# EAGLE design tick-display-mk-2.1-mini (EAGLE 6.5.0)
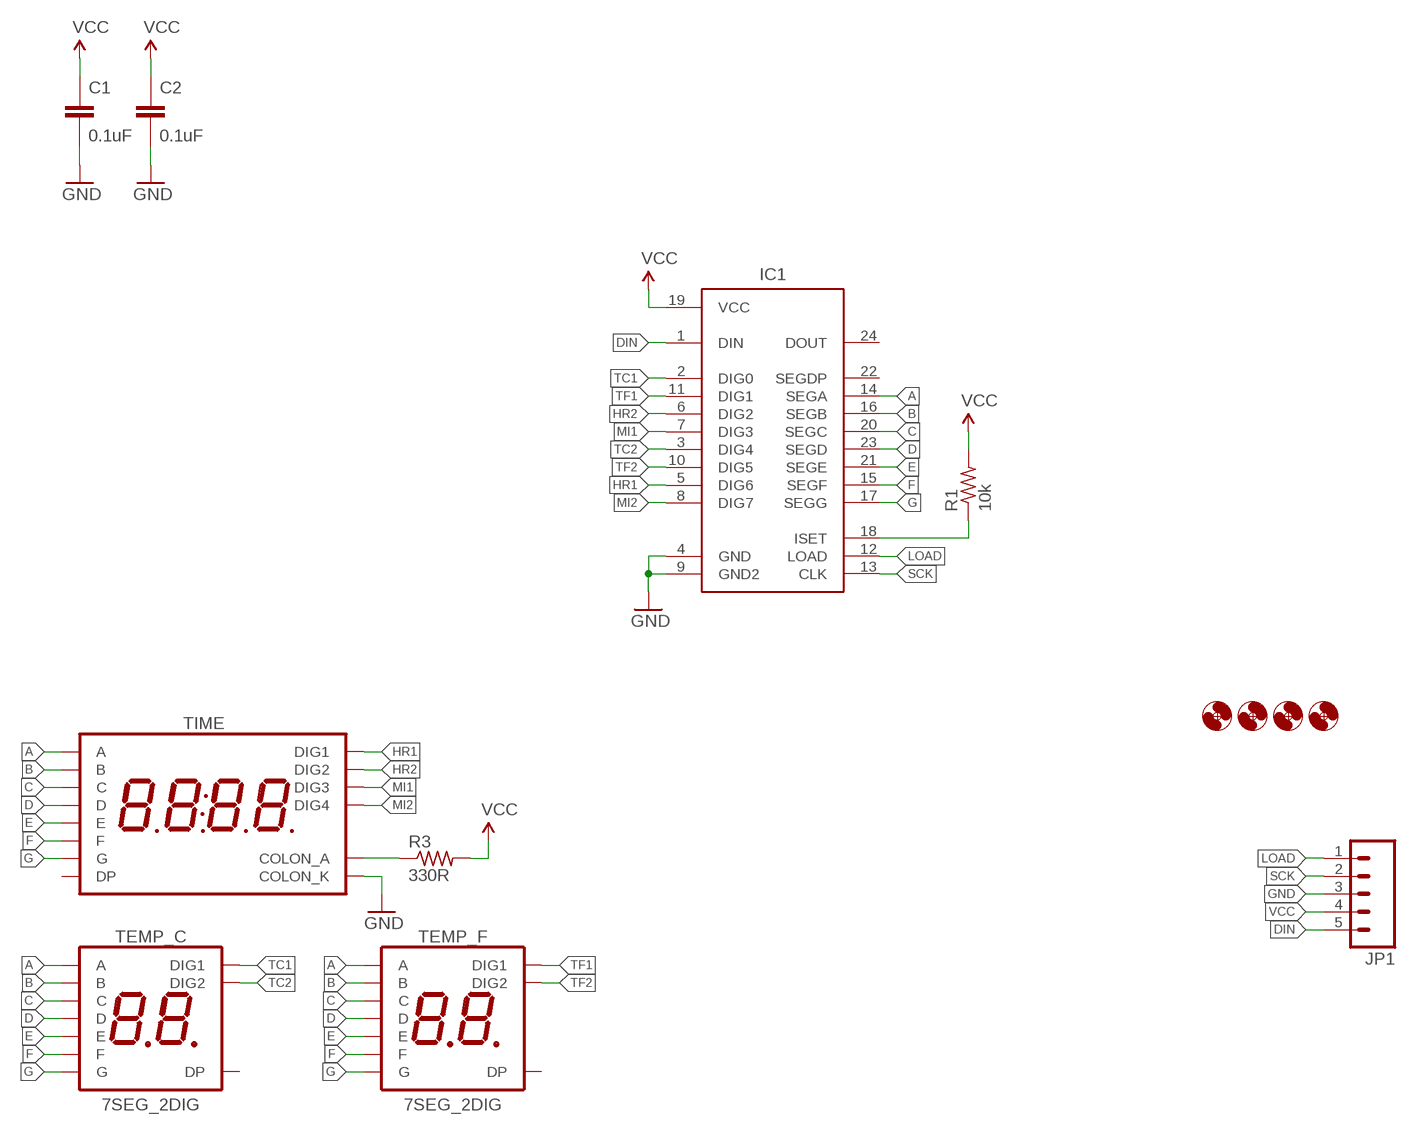
[diagram p0: schematic, sheet 1]

## Parts
C1  0.1uF  CAPACITOR-CERAMIC025-024X044  [C025-024X044]
C2  0.1uF  CAPACITOR-CERAMIC025-024X044  [C025-024X044]
H1  HOLE#2  [HOLE-#2]
H2  HOLE#2  [HOLE-#2]
H3  HOLE#2  [HOLE-#2]
H4  HOLE#2  [HOLE-#2]
IC1  MAX7219DIP  [DIL24]
JP1  M05JST-PH-VERT-PTH  [JST-5-PH-VERT-PTH]
R1  10k  RESISTORPTH-AXIAL-5.08MM  [RESISTOR-AXIAL-PTH-5.08MM]
R3  330R  RESISTORPTH-AXIAL-5.08MM  [RESISTOR-AXIAL-PTH-5.08MM]
TEMP_C  7SEG_2DIG  [7SEG_2DIG_14MM]
TEMP_F  7SEG_2DIG  [7SEG_2DIG_14MM]
TIME  7SED_4DIGIT_14MM14.2MM-CC  [7SEG_4DIG]

## Nets
A: IC1.14(SEGA) TEMP_C.4(A) TEMP_F.4(A) TIME.P$13(A)
B: IC1.16(SEGB) TEMP_C.3(B) TEMP_F.3(B) TIME.P$9(B)
C: IC1.20(SEGC) TEMP_C.9(C) TEMP_F.9(C) TIME.P$4(C)
D: IC1.23(SEGD) TEMP_C.8(D) TEMP_F.8(D) TIME.P$2(D)
DIN: IC1.1(DIN) JP1.5
E: IC1.21(SEGE) TEMP_C.6(E) TEMP_F.6(E) TIME.P$1(E)
F: IC1.15(SEGF) TEMP_C.7(F) TEMP_F.7(F) TIME.P$12(F)
G: IC1.17(SEGG) TEMP_C.1(G) TEMP_F.1(G) TIME.P$5(G)
GND: C1.2 C2.2 IC1.4(GND) IC1.9(GND2) JP1.3 TIME.P$7(COLON_K)
HR1: IC1.5(DIG6) TIME.P$14(DIG1)
HR2: IC1.6(DIG2) TIME.P$11(DIG2)
LOAD: IC1.12(LOAD) JP1.1
MI1: IC1.7(DIG3) TIME.P$10(DIG3)
MI2: IC1.8(DIG7) TIME.P$6(DIG4)
N$2: IC1.18(ISET) R1.P$1
N$18: R3.P$1 TIME.P$8(COLON_A)
SCK: IC1.13(CLK) JP1.2
TC1: IC1.2(DIG0) TEMP_C.5(DIG1)
TC2: IC1.3(DIG4) TEMP_C.10(DIG2)
TF1: IC1.11(DIG1) TEMP_F.5(DIG1)
TF2: IC1.10(DIG5) TEMP_F.10(DIG2)
VCC: C1.1 C2.1 IC1.19(VCC) JP1.4 R1.P$2 R3.P$2
Unconnected: IC1.22(SEGDP) IC1.24(DOUT) TEMP_C.2(DP) TEMP_F.2(DP) TIME.P$3(DP)

## Library data of the parts
C1 C2 = A_butts:CAPACITOR-CERAMIC: CAPACITOR, European symbol
H1-H4 = A_butts:HOLE: MOUNTING HOLE with drill center marker
IC1 = A_butts:MAX7219: 8-digit, 8-segment LED display driver, serial input
JP1 = A_butts:M05: Header 5 Standard 5-pin 0.1" header. Use with straight break away headers (SKU : PRT-00116), right angle break away headers (PRT-00553), swiss pins (PRT-00743), machine pins (PRT-00117), and female headers (PRT-00115). Molex polarized connector foot print use with SKU : PRT-08230 with associated crimp pins and housings.
R1 R3 = A_butts:RESISTOR: RESISTOR, American symbol
TEMP_C TEMP_F = A_butts:7SEG_2DIG
TIME = A_butts:7SED_4DIGIT_14MM

## Board
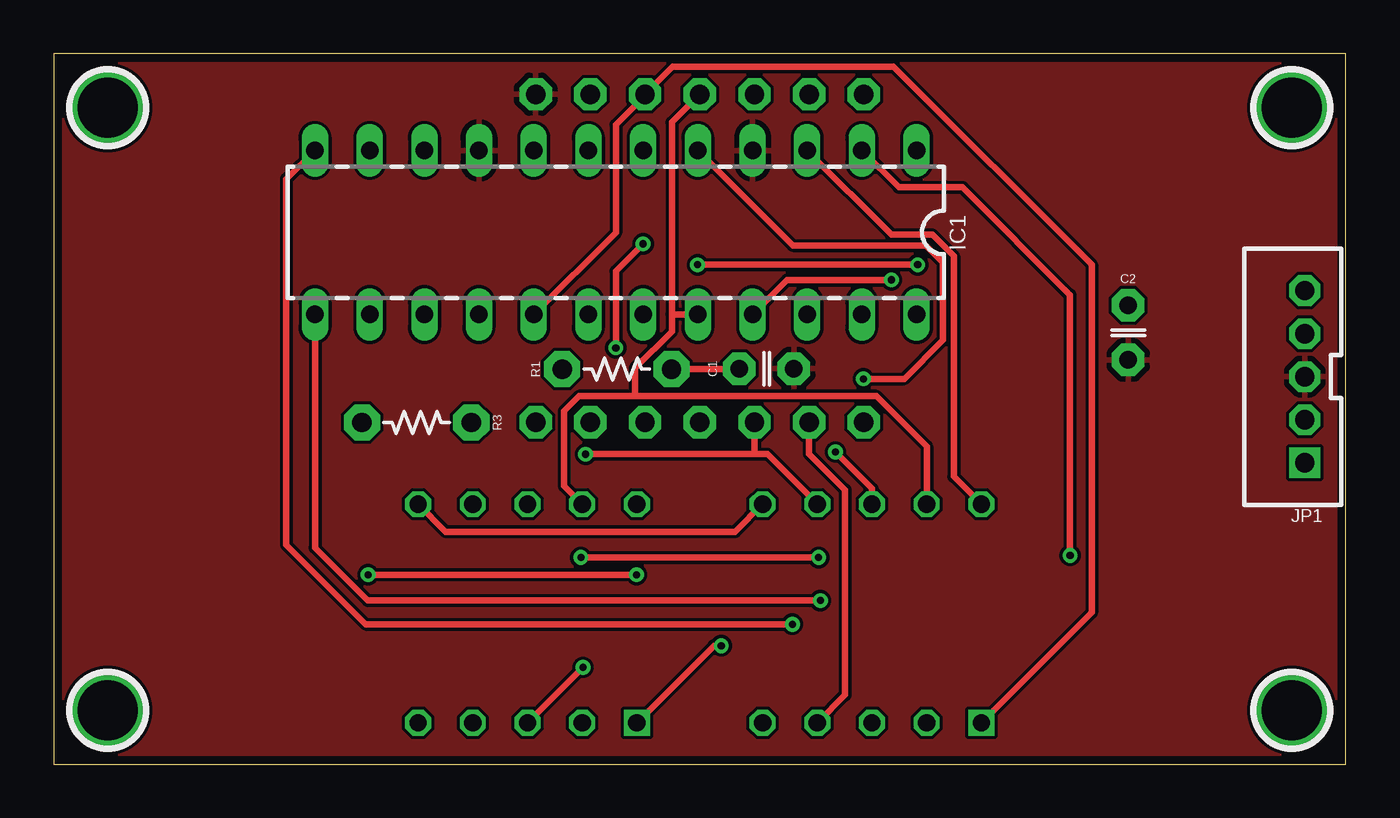
[diagram p1: board, top side]
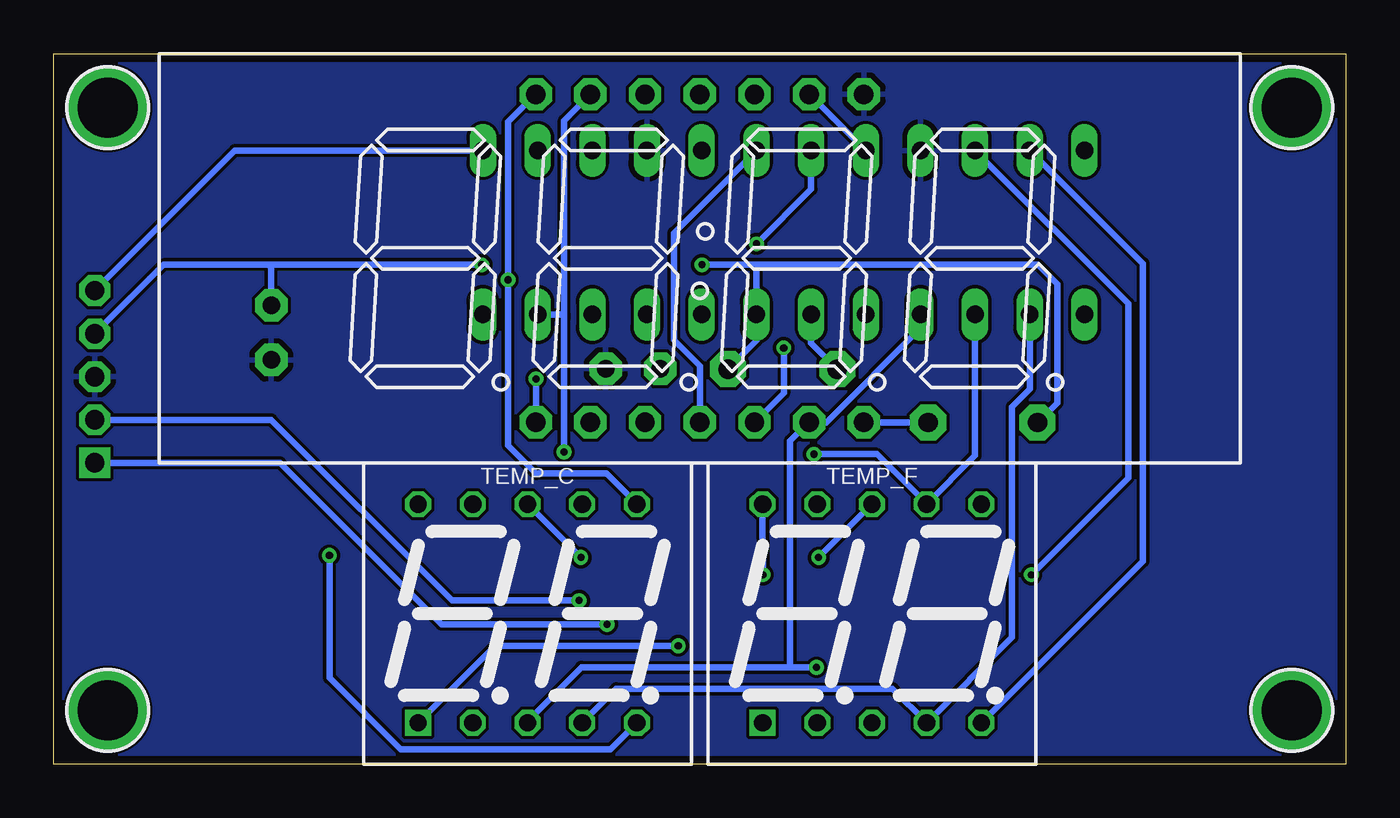
[diagram p2: board, bottom side, seen from below]

Size 60 x 33 mm. Coordinates in mm from the lower left corner, seen from the top.
Outline: 0,0 60,0 60,33 0,33 0,0
Copper layers (1*16): Top 0.0356mm / dielectric 1.5011mm / Bottom 0.0356mm
Design rules "LaenPCBOrder2": minimum track width 6mil, minimum drill 13mil, track to track 6mil, track to pad 6mil, pad to pad 6mil, via to via 6mil, smd to smd 6mil, copper to edge 15mil, drill to drill 6mil, minimum pad ring 7mil, minimum via ring 7mil, stop-mask expansion 3mil, vias tented up to drill 20mil, thermal gap 10mil

### Footprints (pad centres in the part's own frame; a part is rotated, then mirrored left to right if it is on the bottom)
C025-024X044 = drill 0.813 pad 1.5 octagon: 1 -1.27,0; 2 1.27,0
HOLE-#2 = drill 2.8 pad 3.81: P$1 0,0
DIL24 = drill 0.813 long: 1 -13.97,-3.81; 2 -11.43,-3.81; 3 -8.89,-3.81; 4 -6.35,-3.81; 5 -3.81,-3.81; 6 -1.27,-3.81; 7 1.27,-3.81; 8 3.81,-3.81; 9 6.35,-3.81; 10 8.89,-3.81; 11 11.43,-3.81; 12 13.97,-3.81; 13 13.97,3.81; 14 11.43,3.81; 15 8.89,3.81; 16 6.35,3.81; 17 3.81,3.81; 18 1.27,3.81; 19 -1.27,3.81; 20 -3.81,3.81; 21 -6.35,3.81; 22 -8.89,3.81; 23 -11.43,3.81; 24 -13.97,3.81
JST-5-PH-VERT-PTH = drill 0.9 pad 1.422 square: 1 -4,0 | drill 0.9 pad 1.422 octagon: 2 -2,0; 3 0,0; 4 2,0; 5 4,0
RESISTOR-AXIAL-PTH-5.08MM = drill 0.9 pad 1.676 octagon: P$1 -2.54,0; P$2 2.54,0
7SEG_2DIG_14MM = drill 0.8 square: 1 -5.08,-5.08 | drill 0.8 octagon: 2 -2.54,-5.08; 3 0,-5.08; 4 2.54,-5.08; 5 5.08,-5.08; 6 5.08,5.08; 7 2.54,5.08; 8 0,5.08; 9 -2.54,5.08; 10 -5.08,5.08
7SEG_4DIG = drill 0.9 pad 1.5 octagon: P$1 -7.62,7.62; P$2 -5.08,7.62; P$3 -2.54,7.62; P$4 0,7.62; P$5 2.54,7.62; P$6 5.08,7.62; P$7 7.62,7.62; P$8 7.62,-7.62; P$9 5.08,-7.62; P$10 2.54,-7.62; P$11 0,-7.62; P$12 -2.54,-7.62; P$13 -5.08,-7.62; P$14 -7.62,-7.62

### Placement (x,y rotation side)
C1  33.1,18.37 0 top
C2  49.9,20.05 270 top
H1  2.5,30.5 0 top
H2  57.5,30.5 0 top
H3  2.5,2.5 0 top
H4  57.5,2.5 0 top
IC1  26.1,24.7 180 top
JP1  58.1,18 90 top
R1  26.15,18.35 0 top
R3  16.85,15.87 180 top
TEMP_C  38,7 0 bottom
TEMP_F  22,7 0 bottom
TIME  30,23.5 0 bottom

### Tracks (layer width: path | path; a pad name or v marks a point on that pad's centre or on a via)
A
  Top 0.305: TIME.P$13 35.08,14.42 36.75,12.75 36.75,3.21 TEMP_C.4
  Bottom 0.305: TEMP_C.4 33.88,3.5 21.04,3.5 TEMP_F.4 15.5,5.88 15.5,16.6 14.67,17.43 IC1.14
B  (via drill 0.33)
  Top 0.305: v24.58,4.5 TEMP_F.3
  Bottom 0.305: TEMP_C.3 38,2 35.5,4.5 25.8,4.5 | 25.8,4.5 v24.58,4.5 | 25.8,4.5 25.8,15.02 24.92,15.9 TIME.P$9 24.12,15.88 19.75,20.25 IC1.16
C
  Top 0.305: TIME.P$4 28.7,29.82 28.7,20.89 | 28.7,20.89 28.7,20.1 27,18.4 27,17.2 27.1,17.1 | TEMP_F.9 23.7,12.92 23.7,16.4 24.4,17.1 27.1,17.1 | TEMP_C.9 40.54,14.76 38.2,17.1 27.1,17.1 | IC1.20 28.7,20.89
D  (via drill 0.33)
  Top 0.305: TEMP_C.8 38,12.8 v36.3,14.5 | v24.48,9.6 v35.52,9.6
  Bottom 0.305: v36.3,14.5 36.3,20.7 36.3,20.89 | 36.3,20.89 36.3,29.9 TIME.P$2 | TEMP_F.8 v24.48,9.6 | v35.52,9.6 TEMP_C.8 | IC1.23 36.3,20.89
DIN
  Bottom 0.305: IC1.1 51.59,28.51 JP1.5
E  (via drill 0.33)
  Top 0.305: TEMP_C.6 31.64,10.8 18.2,10.8 TEMP_F.6 | IC1.21 34.06,22.5 v38.9,22.5
  Bottom 0.305: TEMP_C.6 34.34,13.5 37.6,13.5 38.9,14.8 v38.9,22.5 38.9,29.84 TIME.P$1
F  (via drill 0.33)
  Top 0.305: v24.7,14.4 32.54,14.4 | 32.54,14.4 33.14,14.4 TEMP_C.7 | TIME.P$12 32.54,14.4
  Bottom 0.305: v24.7,14.4 21.78,14.4 TEMP_F.7 17.21,14.33 IC1.15
G  (via drill 0.33)
  Top 0.305: v31,5.5 30.66,5.5 TEMP_F.1 | TEMP_C.1 48.2,7.04 48.2,23.2 39,32.4 28.74,32.4 TIME.P$5 27.46,31.06 26.1,29.7 26.1,24.7 IC1.17
  Bottom 0.305: TEMP_C.1 39.5,5.5 v31,5.5
GND
  pour Top: 0,0 0,33 60,33 60,0
  pour Bottom: 0,0 0,33 60,33 60,0
HR1  (via drill 0.33)
  Top 0.305: v37.6,17.9 39.5,17.9 41.3,19.7 41.3,23.3 40.5,24.1 34.32,24.1 IC1.5
  Bottom 0.305: TIME.P$14 37.6,15.9 v37.6,17.9
HR2
  Bottom 0.305: TIME.P$11 30,18.5 31.2,19.7 31.2,24.68 IC1.6
LOAD  (via drill 0.33)
  Top 0.305: IC1.12 10.8,27.18 10.8,10.19 14.49,6.5 v34.3,6.5
  Bottom 0.305: v34.3,6.5 42,6.5 49.5,14 JP1.1
MI1  (via drill 0.33)
  Top 0.305: v27.37,24.17 26.1,22.9 v26.1,19.34
  Bottom 0.305: v26.1,19.34 26.1,17.24 TIME.P$10 | v27.37,24.17 24.83,26.71 IC1.7
MI2
  Bottom 0.305: TIME.P$6 24.9,31.12 IC1.8
N$2
  Bottom 0.305: R1.P$1 24.83,19.57 IC1.18
N$18
  Bottom 0.305: R3.P$1 TIME.P$8
SCK  (via drill 0.33)
  Top 0.305: IC1.13 12.13,10.05 14.58,7.6 v35.6,7.6
  Bottom 0.305: v35.6,7.6 41.5,7.6 49.9,16 JP1.2
TC1  (via drill 0.33)
  Top 0.305: IC1.2 39.24,26.8 42.2,26.8 47.2,21.8 v47.2,9.7
  Bottom 0.305: TEMP_C.5 34.14,0.7 43.9,0.7 47.2,4 v47.2,9.7
TC2
  Top 0.305: IC1.3 38.9,24.6 40.8,24.6 41.8,23.6 41.8,13.36 TEMP_C.10
  Bottom 0.305: TEMP_C.10 43.1,12.1
TF1
  Bottom 0.305: TEMP_F.5 9.42,9.42 9.42,23.26 IC1.11
TF2  (via drill 0.33)
  Top 0.305: v27.06,8.8 v14.6,8.8
  Bottom 0.305: TEMP_F.10 v27.06,8.8 | IC1.10 10.1,21.4 10.1,13.3 v14.6,8.8
VCC  (via drill 0.33)
  Top 0.305: v29.9,23.2 v40.12,23.2 | C1.1 31.81,18.35 R1.P$2
  Bottom 0.305: R3.P$2 13.4,16.78 13.4,22.3 14.3,23.2 27.4,23.2 | 27.4,23.2 v29.9,23.2 | v40.12,23.2 50,23.2 | 50,23.2 54.9,23.2 JP1.4 | 27.4,23.2 27.37,23.17 IC1.19 27.37,19.67 R1.P$2 | C2.1 49.9,23.1 50,23.2